# Altium schematic sheet Top Level Sheet.SchDoc
size A4; SheetNumber: 1; SheetTotal: 6
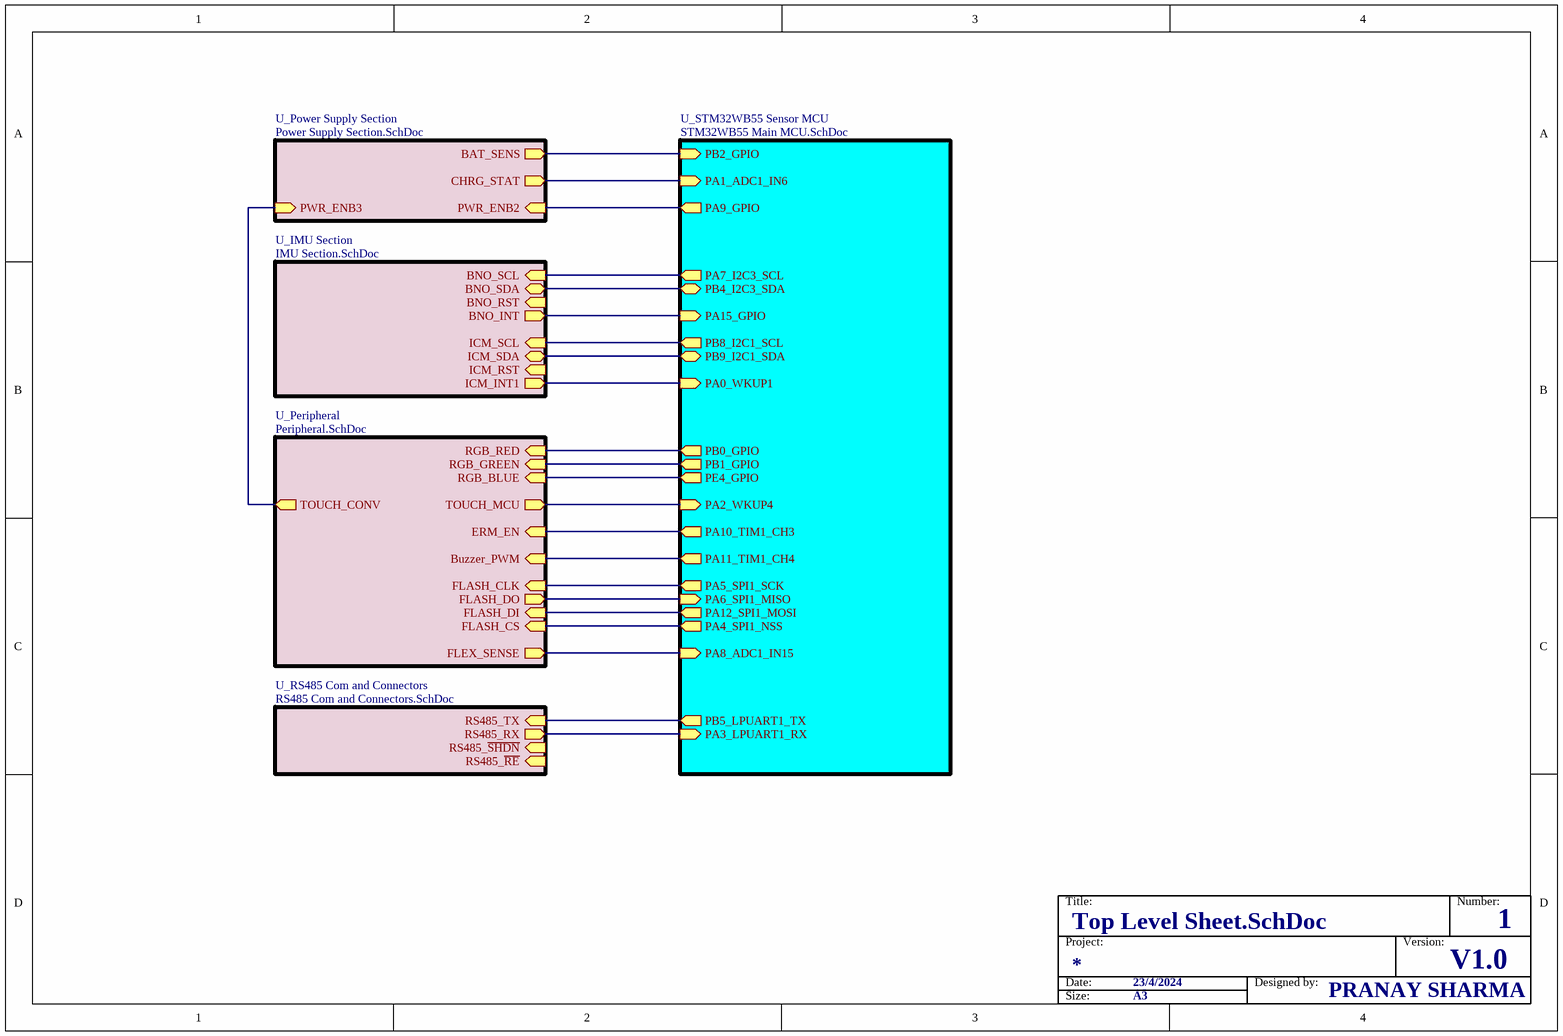
[diagram p0: Top Level Sheet.SchDoc]

## Sub-sheets
U_IMU Section = IMU Section.SchDoc: BNO_SCL (in), BNO_SDA (bidir), BNO_INT (out), BNO_RST (in), ICM_SCL (in), ICM_SDA (bidir), ICM_INT1 (out), ICM_RST (in)
U_Peripheral = Peripheral.SchDoc: Buzzer_PWM (in), TOUCH_MCU (out), TOUCH_CONV (out), ERM_EN (in), RGB_RED (in), RGB_GREEN (in), RGB_BLUE (in), FLASH_CLK (in), FLASH_DO (out), FLASH_CS (in), FLASH_DI (in), FLEX_SENSE (out)
U_Power Supply Section = Power Supply Section.SchDoc: BAT_SENS (out), PWR_ENB2 (in), PWR_ENB3 (in), CHRG_STAT (out)
U_RS485 Com and Connectors = RS485 Com and Connectors.SchDoc: RS485_~{RE} (in), RS485_RX (out), RS485_TX (in), RS485_~{SHDN} (in)
U_STM32WB55 Sensor MCU = STM32WB55 Main MCU.SchDoc: PA1_ADC1_IN6 (in), PA9_GPIO (out), PB2_GPIO (in), PA0_WKUP1 (in), PA7_I2C3_SCL (out), PA15_GPIO (in), PB4_I2C3_SDA (bidir), PB8_I2C1_SCL (out), PB9_I2C1_SDA (bidir), PB0_GPIO (out), PB1_GPIO (out), PE4_GPIO (out), PA3_LPUART1_RX (in), PB5_LPUART1_TX (out), PA10_TIM1_CH3 (out), PA11_TIM1_CH4 (out), PA2_WKUP4 (in), PA4_SPI1_NSS (out), PA5_SPI1_SCK (out), PA6_SPI1_MISO (in), PA12_SPI1_MOSI (out), PA8_ADC1_IN15 (in)

## Nets
(unnamed): sheet U_STM32WB55 Sensor MCU/PA1_ADC1_IN6, sheet U_Power Supply Section/CHRG_STAT
(unnamed): sheet U_STM32WB55 Sensor MCU/PA9_GPIO, sheet U_Power Supply Section/PWR_ENB2
(unnamed): sheet U_STM32WB55 Sensor MCU/PB2_GPIO, sheet U_Power Supply Section/BAT_SENS
(unnamed): sheet U_STM32WB55 Sensor MCU/PA0_WKUP1, sheet U_IMU Section/ICM_INT1
(unnamed): sheet U_STM32WB55 Sensor MCU/PA7_I2C3_SCL, sheet U_IMU Section/BNO_SCL
(unnamed): sheet U_STM32WB55 Sensor MCU/PA15_GPIO, sheet U_IMU Section/BNO_INT
(unnamed): sheet U_STM32WB55 Sensor MCU/PB4_I2C3_SDA, sheet U_IMU Section/BNO_SDA
(unnamed): sheet U_STM32WB55 Sensor MCU/PB8_I2C1_SCL, sheet U_IMU Section/ICM_SCL
(unnamed): sheet U_STM32WB55 Sensor MCU/PB9_I2C1_SDA, sheet U_IMU Section/ICM_SDA
(unnamed): sheet U_STM32WB55 Sensor MCU/PB0_GPIO, sheet U_Peripheral/RGB_RED
(unnamed): sheet U_STM32WB55 Sensor MCU/PB1_GPIO, sheet U_Peripheral/RGB_GREEN
(unnamed): sheet U_STM32WB55 Sensor MCU/PE4_GPIO, sheet U_Peripheral/RGB_BLUE
(unnamed): sheet U_STM32WB55 Sensor MCU/PA3_LPUART1_RX, sheet U_RS485 Com and Connectors/RS485_RX
(unnamed): sheet U_STM32WB55 Sensor MCU/PB5_LPUART1_TX, sheet U_RS485 Com and Connectors/RS485_TX
(unnamed): sheet U_STM32WB55 Sensor MCU/PA10_TIM1_CH3, sheet U_Peripheral/ERM_EN
(unnamed): sheet U_STM32WB55 Sensor MCU/PA11_TIM1_CH4, sheet U_Peripheral/Buzzer_PWM
(unnamed): sheet U_STM32WB55 Sensor MCU/PA2_WKUP4, sheet U_Peripheral/TOUCH_MCU
(unnamed): sheet U_STM32WB55 Sensor MCU/PA4_SPI1_NSS, sheet U_Peripheral/FLASH_CS
(unnamed): sheet U_STM32WB55 Sensor MCU/PA5_SPI1_SCK, sheet U_Peripheral/FLASH_CLK
(unnamed): sheet U_STM32WB55 Sensor MCU/PA6_SPI1_MISO, sheet U_Peripheral/FLASH_DO
(unnamed): sheet U_STM32WB55 Sensor MCU/PA12_SPI1_MOSI, sheet U_Peripheral/FLASH_DI
(unnamed): sheet U_STM32WB55 Sensor MCU/PA8_ADC1_IN15, sheet U_Peripheral/FLEX_SENSE
(unnamed): sheet U_Peripheral/TOUCH_CONV, sheet U_Power Supply Section/PWR_ENB3

## Notes on the sheet
- Title:
- Number:
- Date:
- Project:
- 23/4/2024
- Designed by:
- Version:
- V1.0
- Size:
- A3
- PRANAY SHARMA